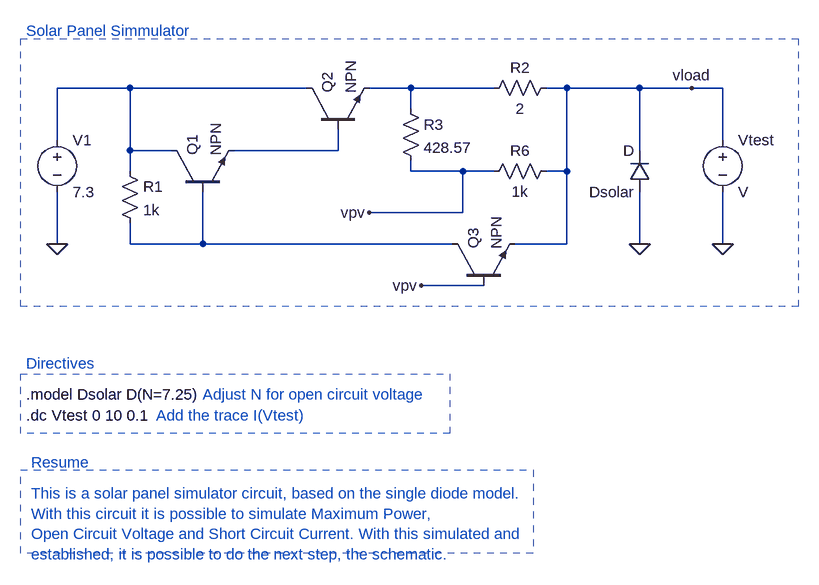
[diagram p0: schematic bjt-simulation-voc-isc.asc]
bjt-simulation-voc-isc.asc, the LTspice schematic file:
Version 4
SHEET 1 1072 1204
WIRE -592 336 -704 336
WIRE -320 336 -592 336
WIRE -160 336 -224 336
WIRE -32 336 -160 336
WIRE 80 336 48 336
WIRE 192 336 80 336
WIRE 272 336 192 336
WIRE 320 336 272 336
WIRE -160 368 -160 336
WIRE -704 416 -704 336
WIRE 320 416 320 336
WIRE -592 432 -592 336
WIRE -528 432 -592 432
WIRE -272 432 -272 400
WIRE -272 432 -432 432
WIRE 192 432 192 336
WIRE -592 464 -592 432
WIRE -160 464 -160 448
WIRE -80 464 -160 464
WIRE -32 464 -80 464
WIRE 80 464 80 336
WIRE 80 464 48 464
WIRE -80 528 -80 464
WIRE -80 528 -224 528
WIRE -704 576 -704 496
WIRE -592 576 -592 544
WIRE -480 576 -480 496
WIRE -480 576 -592 576
WIRE -96 576 -480 576
WIRE 80 576 80 464
WIRE 80 576 0 576
WIRE 192 576 192 496
WIRE 320 576 320 496
WIRE -48 640 -144 640
FLAG -704 576 0
FLAG 192 576 0
FLAG -144 640 vpv
FLAG -224 528 vpv
FLAG 272 336 vload
FLAG 320 576 0
SYMBOL npn3 -528 496 R270
SYMATTR InstName Q1
SYMBOL npn3 -320 400 R270
SYMATTR InstName Q2
SYMBOL npn3 -96 640 R270
SYMATTR InstName Q3
SYMBOL Res -48 352 R270
WINDOW 0 32 56 VTop 2
WINDOW 3 0 56 VBottom 2
SYMATTR InstName R2
SYMATTR Value 2
SYMBOL Res -608 448 R0
SYMATTR InstName R1
SYMATTR Value 1k
SYMBOL Diode 208 496 R180
WINDOW 0 24 64 Left 2
WINDOW 3 24 0 Left 2
SYMATTR InstName D
SYMATTR Value Dsolar
SYMBOL voltage -704 400 R0
SYMATTR InstName V1
SYMATTR Value 7.3
SYMBOL Res 64 448 R90
WINDOW 0 0 56 VBottom 2
WINDOW 3 32 56 VTop 2
SYMATTR InstName R6
SYMATTR Value 1k
SYMBOL Res -176 352 R0
SYMATTR InstName R3
SYMATTR Value 428.57
SYMBOL voltage 320 400 R0
SYMATTR InstName Vtest
TEXT -752 248 Left 2 ;Solar Panel Simmulator
TEXT -744 960 Left 2 ;This is a solar panel simulator circuit, based on the single diode model.\nWith this circuit it is possible to simulate Maximum Power,\nOpen Circuit Voltage and Short Circuit Current. With this simulated and\nestablished, it is possible to do the next step, the schematic.
TEXT -744 912 Left 2 ;Resume
TEXT -752 808 Left 2 !.model Dsolar D(N=7.25)
TEXT -480 808 Left 2 ;Adjust N for open circuit voltage
TEXT -752 840 Left 2 !.dc Vtest 0 10 0.1
TEXT -752 760 Left 2 ;Directives
TEXT -552 840 Left 2 ;Add the trace I(Vtest)
RECTANGLE Normal -760 260 436 672 2
RECTANGLE Normal -760 924 28 1052 2
RECTANGLE Normal -760 776 -100 868 3

The netlist it stands for:
* bjt-simulation-voc-isc.asc
Q1 N001 N004 N003 0 NPN
Q2 N001 N003 N002 0 NPN
Q3 N004 vpv vload 0 NPN
R2 N002 vload 2
R1 N001 N004 1k
D 0 vload Dsolar
V1 N001 0 7.3
R6 vload vpv 1k
R3 N002 vpv 428.57
Vtest vload 0 V
.model D D
.lib standard.dio
.model NPN NPN
.model PNP PNP
.lib standard.bjt
* Solar Panel Simmulator
* This is a solar panel simulator circuit, based on the single diode model.
* With this circuit it is possible to simulate Maximum Power,
* Open Circuit Voltage and Short Circuit Current. With this simulated and
* established, it is possible to do the next step, the schematic.
* Resume
.model Dsolar D(N=7.25)
* Adjust N for open circuit voltage
.dc Vtest 0 10 0.1
* Directives
* Add the trace I(Vtest)
.backanno
.end